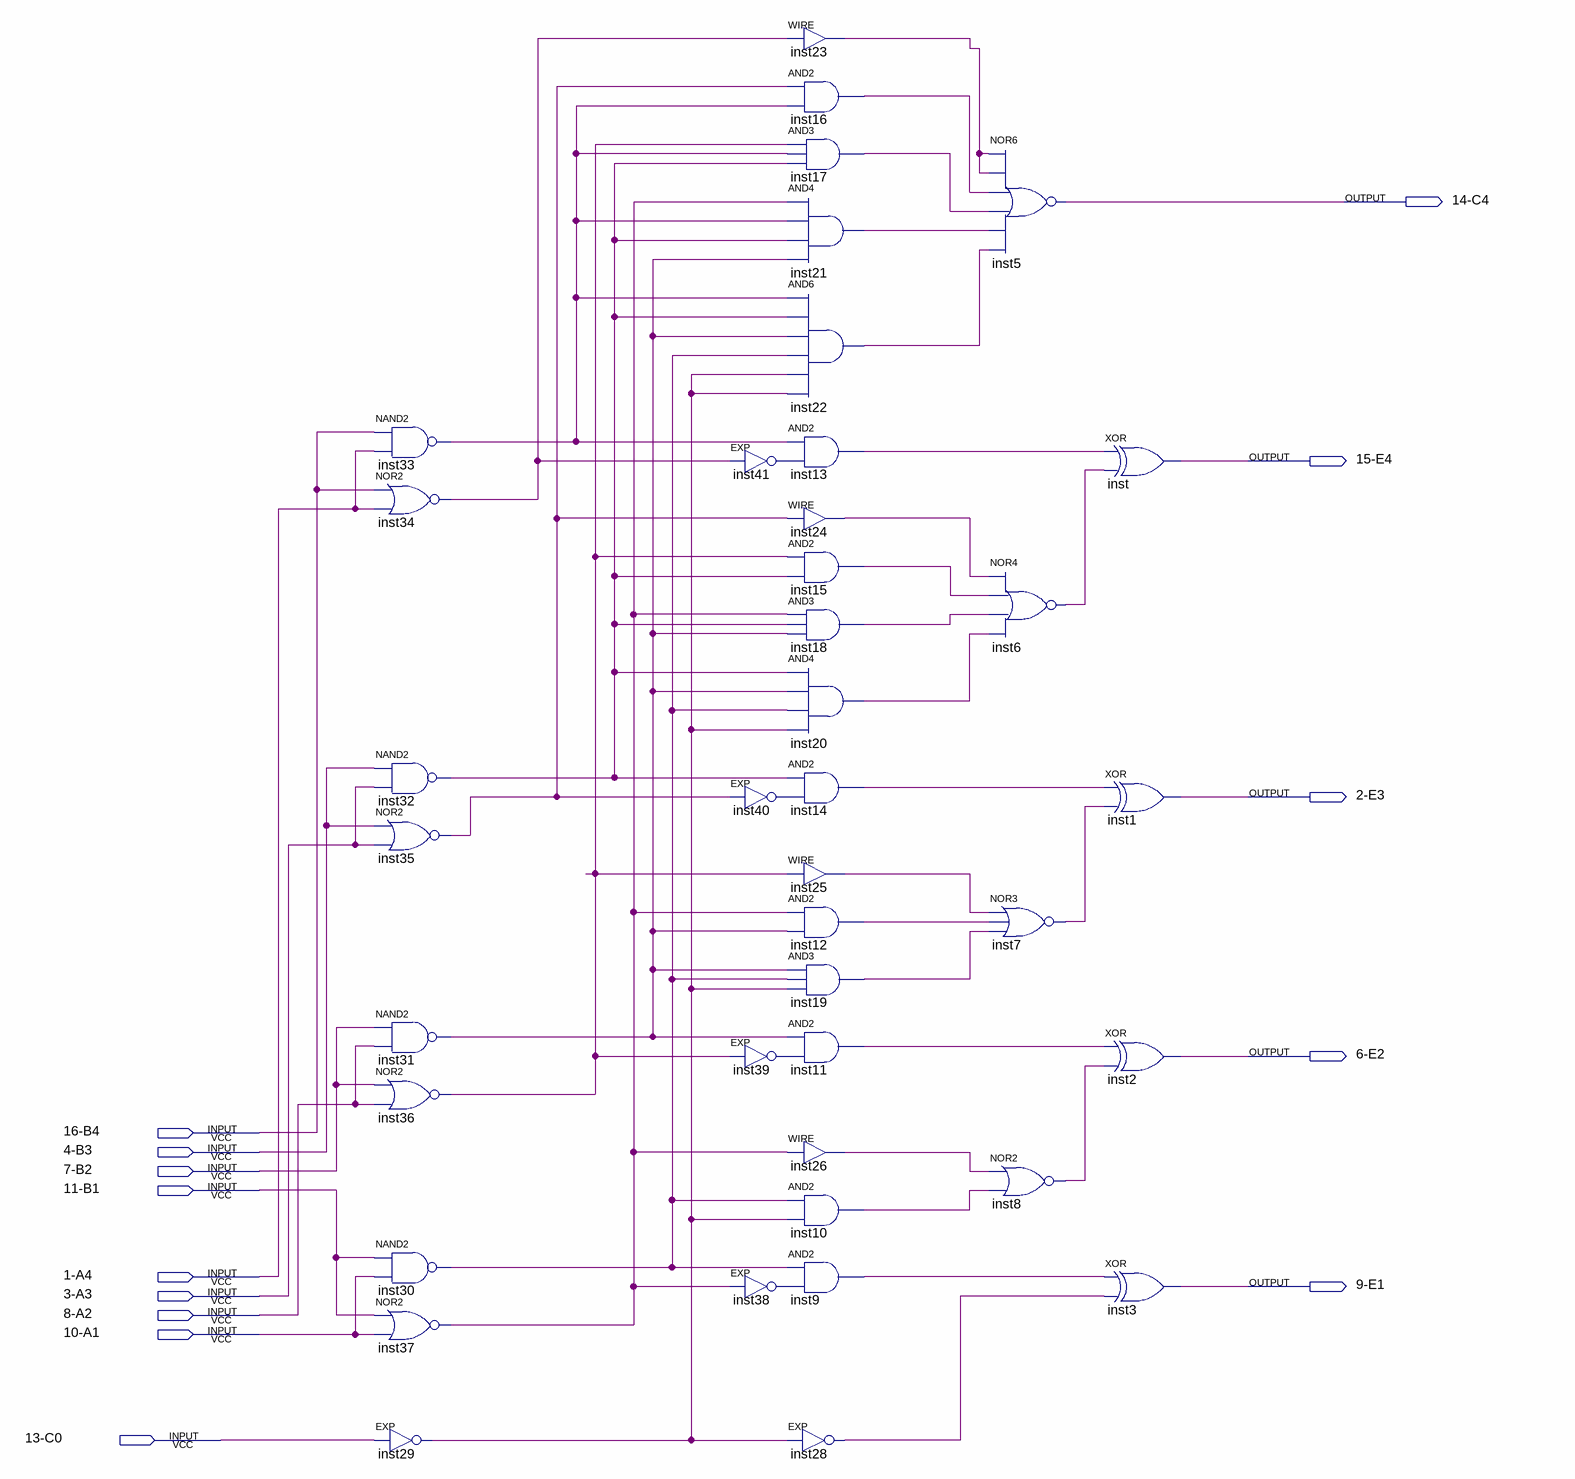
[diagram p0: schematic sheet]
// Quartus schematic 74LS83.bdf as structural Verilog: 40 symbols, 14 pins
module \74LS83  (
  input  \16-B4 ,
  input  \4-B3 ,
  input  \7-B2 ,
  input  \11-B1 ,
  input  \1-A4 ,
  input  \3-A3 ,
  input  \8-A2 ,
  input  \10-A1 ,
  input  \13-C0 ,
  output \14-C4 ,
  output \15-E4 ,
  output \2-E3 ,
  output \6-E2 ,
  output \9-E1 
);

  wire inst6_out, inst7_out, inst8_out, inst9_out, inst10_out, inst11_out, inst12_out, inst13_out,
       inst14_out, inst15_out, inst16_out, inst17_out, inst18_out, inst19_out, inst20_out, inst21_out,
       inst22_out, inst23_out, inst24_out, inst25_out, inst26_out, inst28_out, inst29_out, inst30_out,
       inst31_out, inst32_out, inst33_out, inst34_out, inst35_out, inst36_out, inst37_out, inst38_out,
       inst39_out, inst40_out, inst41_out;

  nand inst33 (inst33_out, \16-B4 , \1-A4 );
  nor inst34 (inst34_out, \16-B4 , \1-A4 );
  nand inst32 (inst32_out, \4-B3 , \3-A3 );
  nor inst35 (inst35_out, \4-B3 , \3-A3 );
  nand inst31 (inst31_out, \7-B2 , \8-A2 );
  nor inst36 (inst36_out, \7-B2 , \8-A2 );
  nand inst30 (inst30_out, \11-B1 , \10-A1 );
  nor inst37 (inst37_out, \11-B1 , \10-A1 );
  EXP inst29 (.IN(\13-C0 ), .OUT(inst29_out));
  EXP inst41 (.IN(inst34_out), .OUT(inst41_out));
  EXP inst40 (.IN(inst35_out), .OUT(inst40_out));
  EXP inst39 (.IN(inst36_out), .OUT(inst39_out));
  EXP inst38 (.IN(inst37_out), .OUT(inst38_out));
  assign inst23_out = inst34_out;  // WIRE inst23
  and inst16 (inst16_out, inst35_out, inst33_out);
  and inst17 (inst17_out, inst36_out, inst33_out, inst32_out);
  and inst21 (inst21_out, inst37_out, inst33_out, inst32_out, inst31_out);
  and inst22 (inst22_out, inst33_out, inst32_out, inst31_out, inst30_out, inst29_out, inst29_out);
  and inst13 (inst13_out, inst33_out, inst41_out);
  assign inst24_out = inst35_out;  // WIRE inst24
  and inst15 (inst15_out, inst36_out, inst32_out);
  and inst18 (inst18_out, inst37_out, inst32_out, inst31_out);
  and inst20 (inst20_out, inst32_out, inst31_out, inst30_out, inst29_out);
  and inst14 (inst14_out, inst32_out, inst40_out);
  assign inst25_out = inst36_out;  // WIRE inst25
  and inst12 (inst12_out, inst37_out, inst31_out);
  and inst19 (inst19_out, inst31_out, inst30_out, inst29_out);
  and inst11 (inst11_out, inst31_out, inst39_out);
  assign inst26_out = inst37_out;  // WIRE inst26
  and inst10 (inst10_out, inst30_out, inst29_out);
  and inst9 (inst9_out, inst30_out, inst38_out);
  EXP inst28 (.IN(inst29_out), .OUT(inst28_out));
  nor inst5 (\14-C4 , inst23_out, inst23_out, inst16_out, inst17_out, inst21_out, inst22_out);
  nor inst6 (inst6_out, inst24_out, inst15_out, inst18_out, inst20_out);
  nor inst7 (inst7_out, inst25_out, inst12_out, inst19_out);
  nor inst8 (inst8_out, inst26_out, inst10_out);
  xor inst (\15-E4 , inst13_out, inst6_out);
  xor inst1 (\2-E3 , inst14_out, inst7_out);
  xor inst2 (\6-E2 , inst11_out, inst8_out);
  xor inst3 (\9-E1 , inst9_out, inst28_out);
endmodule
